# Altium project ISENSIOT-PCB.PrjPcb
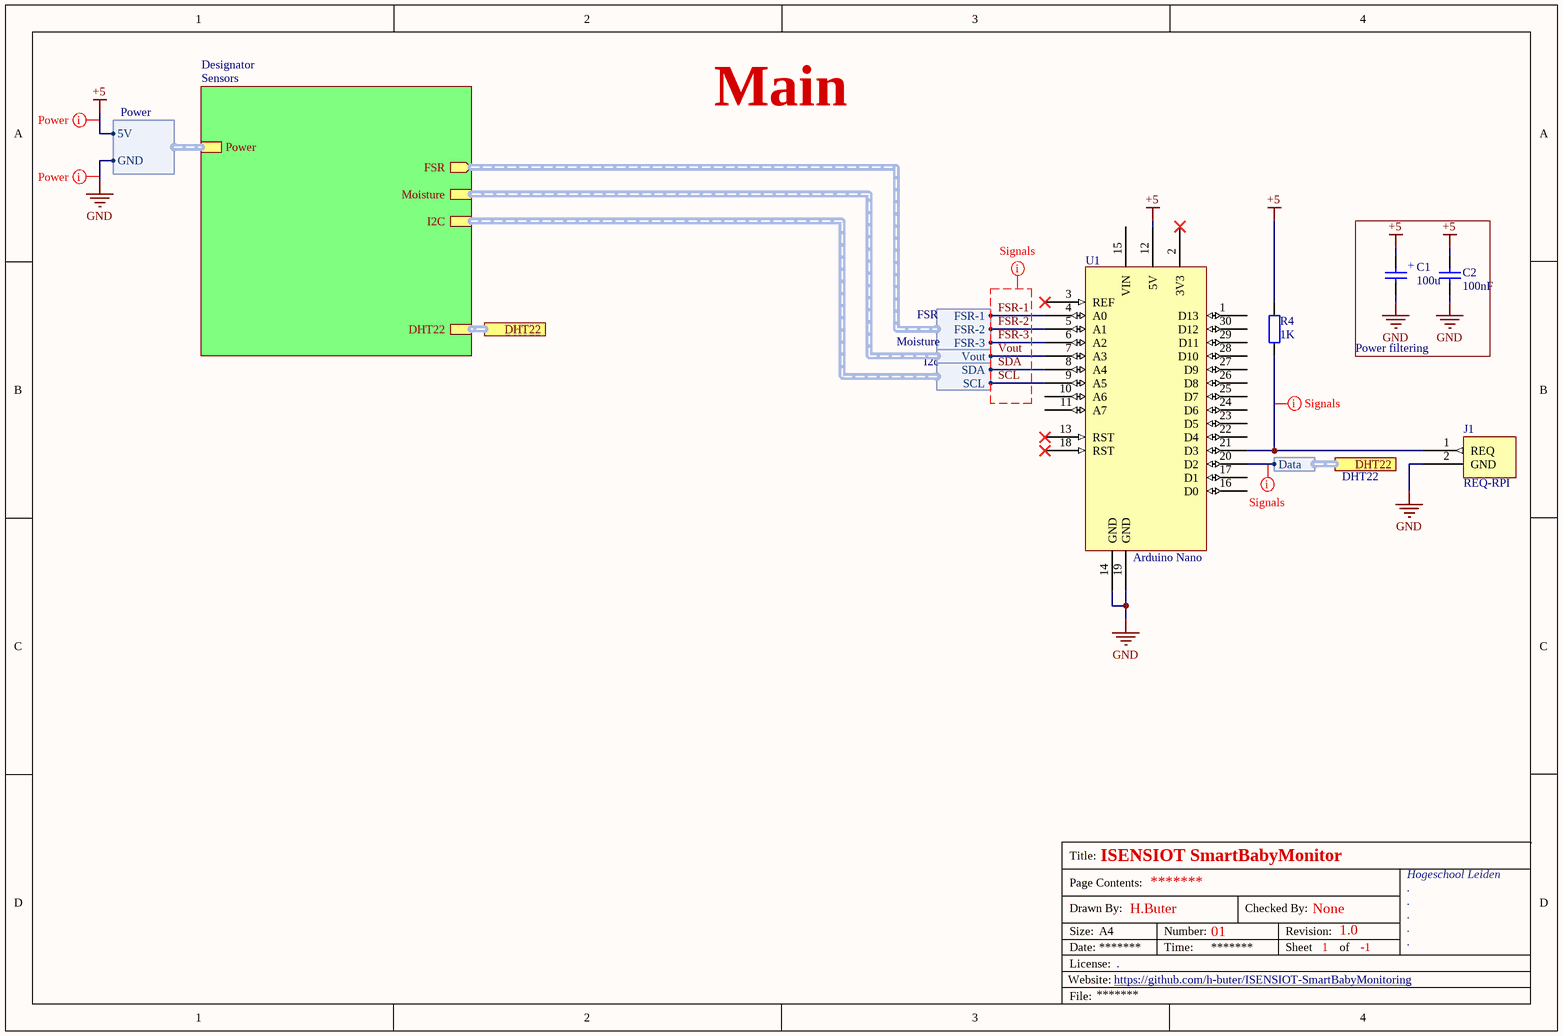
[diagram p0: Main.SchDoc]
Address_City: .; Address_Country: .; Address_Phone: .; Address_State_ZIP: .; Address_Street: .; Address_Website: https://github.com/h-buter/ISENSIOT-SmartBabyMonitoring; Company: Hogeschool Leiden; E-Mail: .; License: .; Project: ISENSIOT SmartBabyMonitor; TotalSheet: -1; VersionRevision: 1.0
2 sheets, 16 parts. Net scope: hierarchical (ports join the sheet entries above them; power ports are global).
Board file: Main.PcbDoc
Sheets:
  Main.SchDoc
    Designator = Sensors.SchDoc

## Sheet Main.SchDoc: Main
size A4; Date: *******; ApprovedBy: *******; CheckedBy: None; Author: *******; CompanyName: *******; DrawnBy: H.Buter; Engineer: *******; Organization: *******; Address1: *******; Address2: *******; Address3: *******; Address4: *******; DocumentNumber: 01; Revision: *******; SheetNumber: 1; SheetTotal: 2; CurrentTime: *******; CurrentDate: *******; Time: *******; DocumentFullPathAndName: *******; DocumentName: *******; ModifiedDate: *******; ImagePath: *******; ProjectName: *******; Application_BuildNumber: *******

### Parts
C1  100u  [Cap 100uF 16V 5x12mm]
C2  100nF  [C1206]
J1  REQ-RPI  [JST-XH 2pin]
R4  1K  [R1206]
U1  Arduino Nano  [Arduino Nano]

### Blocks framed on the sheet
Power filtering: C1 C2

### Sub-sheets
Designator = Sensors: FSR (out, harness FSR), Power (harness Power), I2C (harness I2c), Moisture (harness Moisture), DHT22 (harness DHT22)

### Ports
DHT22 (harness DHT22)

### Harnesses
FSR: FSR-1, FSR-2, FSR-3
Power: 5V, GND
I2c: SCL, SDA
Moisture: Vout
DHT22: Data

### Nets
+5: C1.1 C2.2 R4.2 U1.12(5V) ; sheet Designator/Power.5V
GND: C1.2 C2.1 J1.2(GND) U1.14(GND) U1.19(GND) ; sheet Designator/Power.GND
FSR-1: U1.4(A0) ; sheet Designator/FSR.FSR-1
FSR-2: U1.5(A1) ; sheet Designator/FSR.FSR-2
FSR-3: U1.6(A2) ; sheet Designator/FSR.FSR-3
SCL: U1.9(A5) ; sheet Designator/I2C.SCL
SDA: U1.8(A4) ; sheet Designator/I2C.SDA
Vout: U1.7(A3) ; sheet Designator/Moisture.Vout
NetJ1_1: J1.1(REQ) R4.1 U1.21(D3)
NetR5_1: U1.20(D2) ; port DHT22.Data

Not connected (* = marked no-connect by the designer): U1 1(D13) 2(3V3)* 3(REF)* 10(A6) 11(A7) 13(RST)* 15(VIN) 16(D0) 17(D1) 18(RST)* 22(D4) 23(D5) 24(D6) 25(D7) 26(D8) 27(D9) 28(D10) 29(D11) 30(D12)

### Buses and harness runs
harness port DHT22 = sheet Designator/DHT22

### Layout directives
net class Power: +5, GND
net class Signals: FSR-1, FSR-2, FSR-3, NetJ1_1, NetR5_1, SCL, SDA, Vout

### Notes on the sheet
- (near C1) Place @{"Id":"XWYLUBRW\MARYOLLX","ObjectType":2} and @{"Id":"XWYLUBRW\RRCBYOYS","ObjectType":2} as close as possible to the power pins of @{"Id":"XWYLUBRW\YIIVKUMM","ObjectType":2}
- Title:
- Drawn By:
- Page Contents:
- Checked By:
- Website:
- Size:
- Date:
- File:
- License:
- A4
- Number:
- Time:
- Revision:
- Sheet
- of
- (in symbol Cap 100uF 16V 5x12mm) +

### Library data of the parts
C1 = Cap 100uF 16V 5x12mm: value: 100u
C2 = Capacitor_1206: SMD Capacitor 1206; Published: 03-11-2016; LatestRevisionDate: 03-11-2016; LatestRevisionNote: Creation; PackageReference: C1206; Publisher: Windesheim; PackageDescription: Chip Capacitor, Body 3.2x1.6mm, Height 1.7mm, IPC Medium Density; Value: 100nF
J1 = REQ-RPI: Request connection to Raspberry Pi
R4 = Resistor_1206: SMD Resistor 1206; Published: 03-11-2016; LatestRevisionDate: 03-11-2016; LatestRevisionNote: Creation; PackageReference: R1206; Publisher: Windesheim; PackageDescription: Chip Resistor, Body 3.2x1.6mm, IPC Medium Density; Value: 1K

## Sheet Sensors.SchDoc
size A4; SheetNumber: 2; SheetTotal: 2
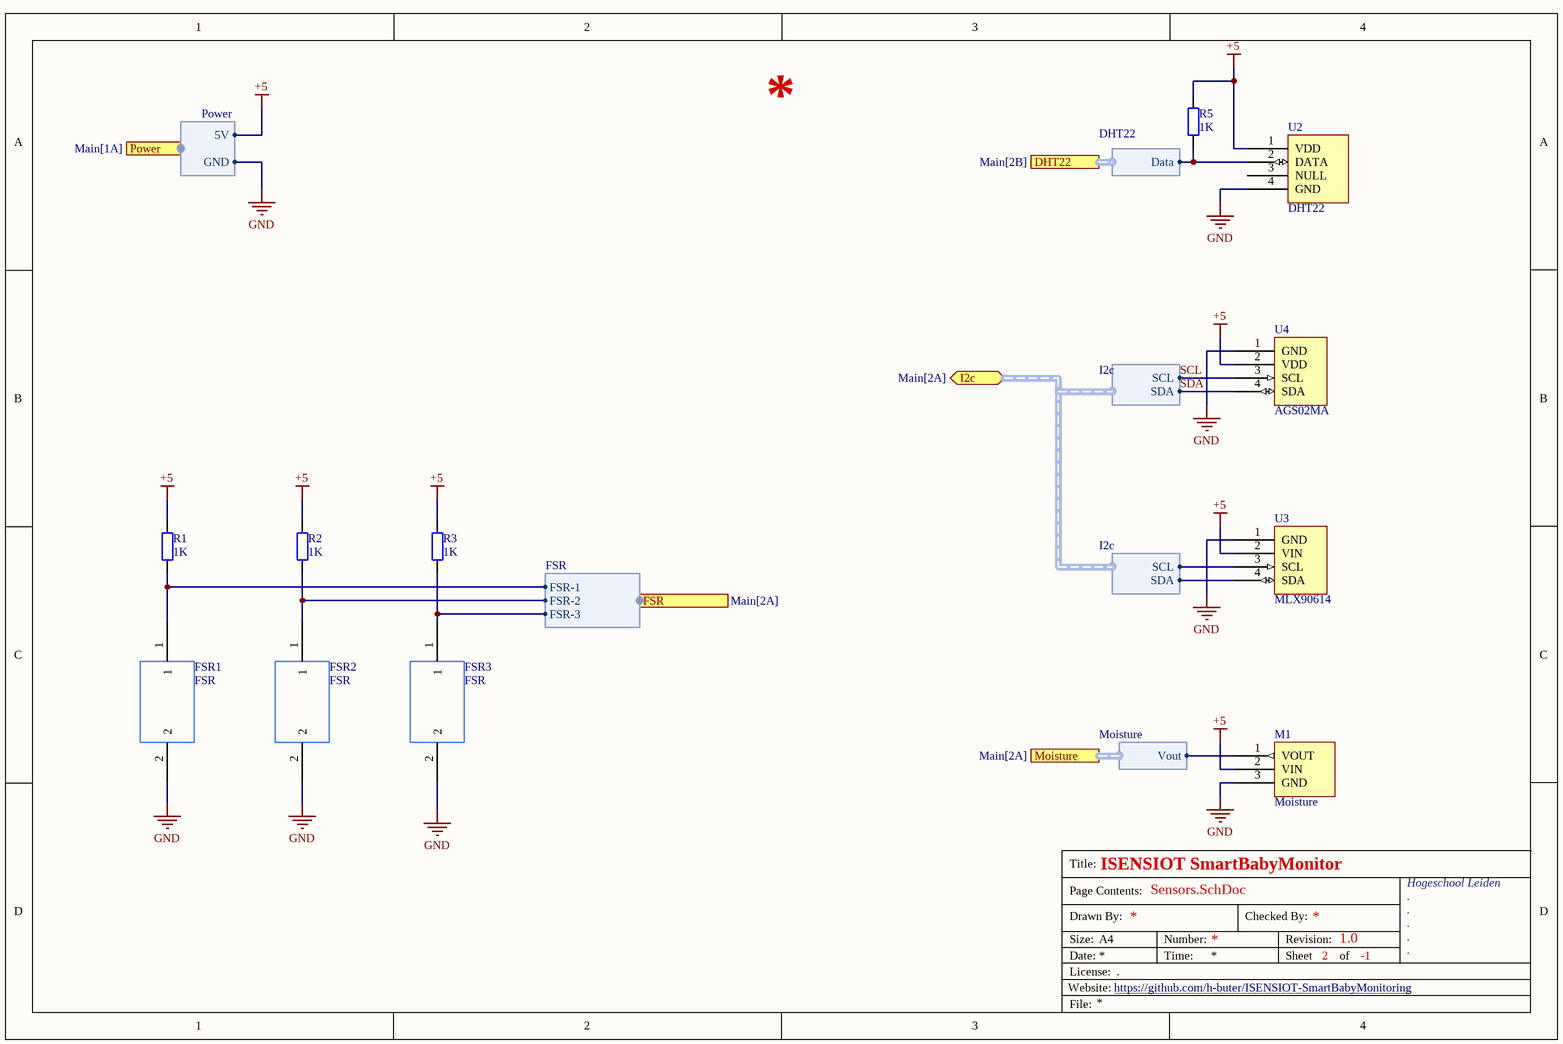
[diagram p1: Sensors.SchDoc]

### Parts
FSR1  FSR  [JST-XH 2pin]
FSR2  FSR  [JST-XH 2pin]
FSR3  FSR  [JST-XH 2pin]
M1  Moisture  [JST-XH 3PIN]
R1  1K  [R1206]
R2  1K  [R1206]
R3  1K  [R1206]
R5  1K  [R1206]
U2  DHT22  [JST-XH 4PIN]
U3  MLX90614  [JST-XH 4PIN]
U4  AGS02MA  [JST-XH 4PIN]

### Ports
DHT22 (harness DHT22, see Main[2B]), FSR (harness FSR, see Main[2A]), I2c (bidir, harness I2c, see Main[2A]), Moisture (harness Moisture, see Main[2A]), Power (harness Power, see Main[1A])

### Harnesses
FSR: FSR-1, FSR-2, FSR-3
Power: 5V, GND
I2c: SDA, SCL
Moisture: Vout
DHT22: Data

### Nets
+5: M1.2(VIN) R1.2 R2.2 R3.2 R5.2 U2.1(VDD) U3.2(VIN) U4.2(VDD) ; port Power.5V
GND: FSR1.2 FSR2.2 FSR3.2 M1.3(GND) U2.4(GND) U3.1(GND) U4.1(GND) ; port Power.GND
FSR-1: FSR1.1 R1.1 ; port FSR.FSR-1
FSR-2: FSR2.1 R2.1 ; port FSR.FSR-2
FSR-3: FSR3.1 R3.1 ; port FSR.FSR-3
SCL: U3.3(SCL) U4.3(SCL) ; port I2c.SCL
SDA: U3.4(SDA) U4.4(SDA) ; port I2c.SDA
Vout: M1.1(VOUT) ; port Moisture.Vout
NetR5_1: R5.1 U2.2(DATA) ; port DHT22.Data

Not connected (* = marked no-connect by the designer): U2 3(NULL)

### Notes on the sheet
- Title:
- Drawn By:
- Page Contents:
- Checked By:
- Website:
- Size:
- Date:
- File:
- License:
- A4
- Number:
- Time:
- Revision:
- Sheet
- of

### Library data of the parts
FSR1-FSR3 = FSR: 2 pin JST connector
R1-R3 R5 = Resistor_1206: SMD Resistor 1206; Published: 03-11-2016; LatestRevisionDate: 03-11-2016; LatestRevisionNote: Creation; PackageReference: R1206; Publisher: Windesheim; PackageDescription: Chip Resistor, Body 3.2x1.6mm, IPC Medium Density; Value: 1K
U2 = DHT22: https://www.tinytronics.nl/en/sensors/air/humidity/dht22-thermometer-temperature-and-humidity-sensor
U3 = MLX90614: https://www.tinytronics.nl/en/sensors/temperature/non-contact-ir-temperature-sensor-module-mlx90614-baa-90

## Nets that join several sheets
+5: Main (C1.1 C2.2 R4.2 U1.12), Sensors (8 pins)
GND: Main (5 pins), Sensors (7 pins)
FSR-1: Main (U1.4), Sensors (FSR1.1 R1.1)
FSR-2: Main (U1.5), Sensors (FSR2.1 R2.1)
FSR-3: Main (U1.6), Sensors (FSR3.1 R3.1)
NetR5_1: Main (U1.20), Sensors (R5.1 U2.2)
SCL: Main (U1.9), Sensors (U3.3 U4.3)
SDA: Main (U1.8), Sensors (U3.4 U4.4)
Vout: Main (U1.7), Sensors (M1.1)